# EAGLE design Button-LED-Breakout-v10 (EAGLE 6.4)
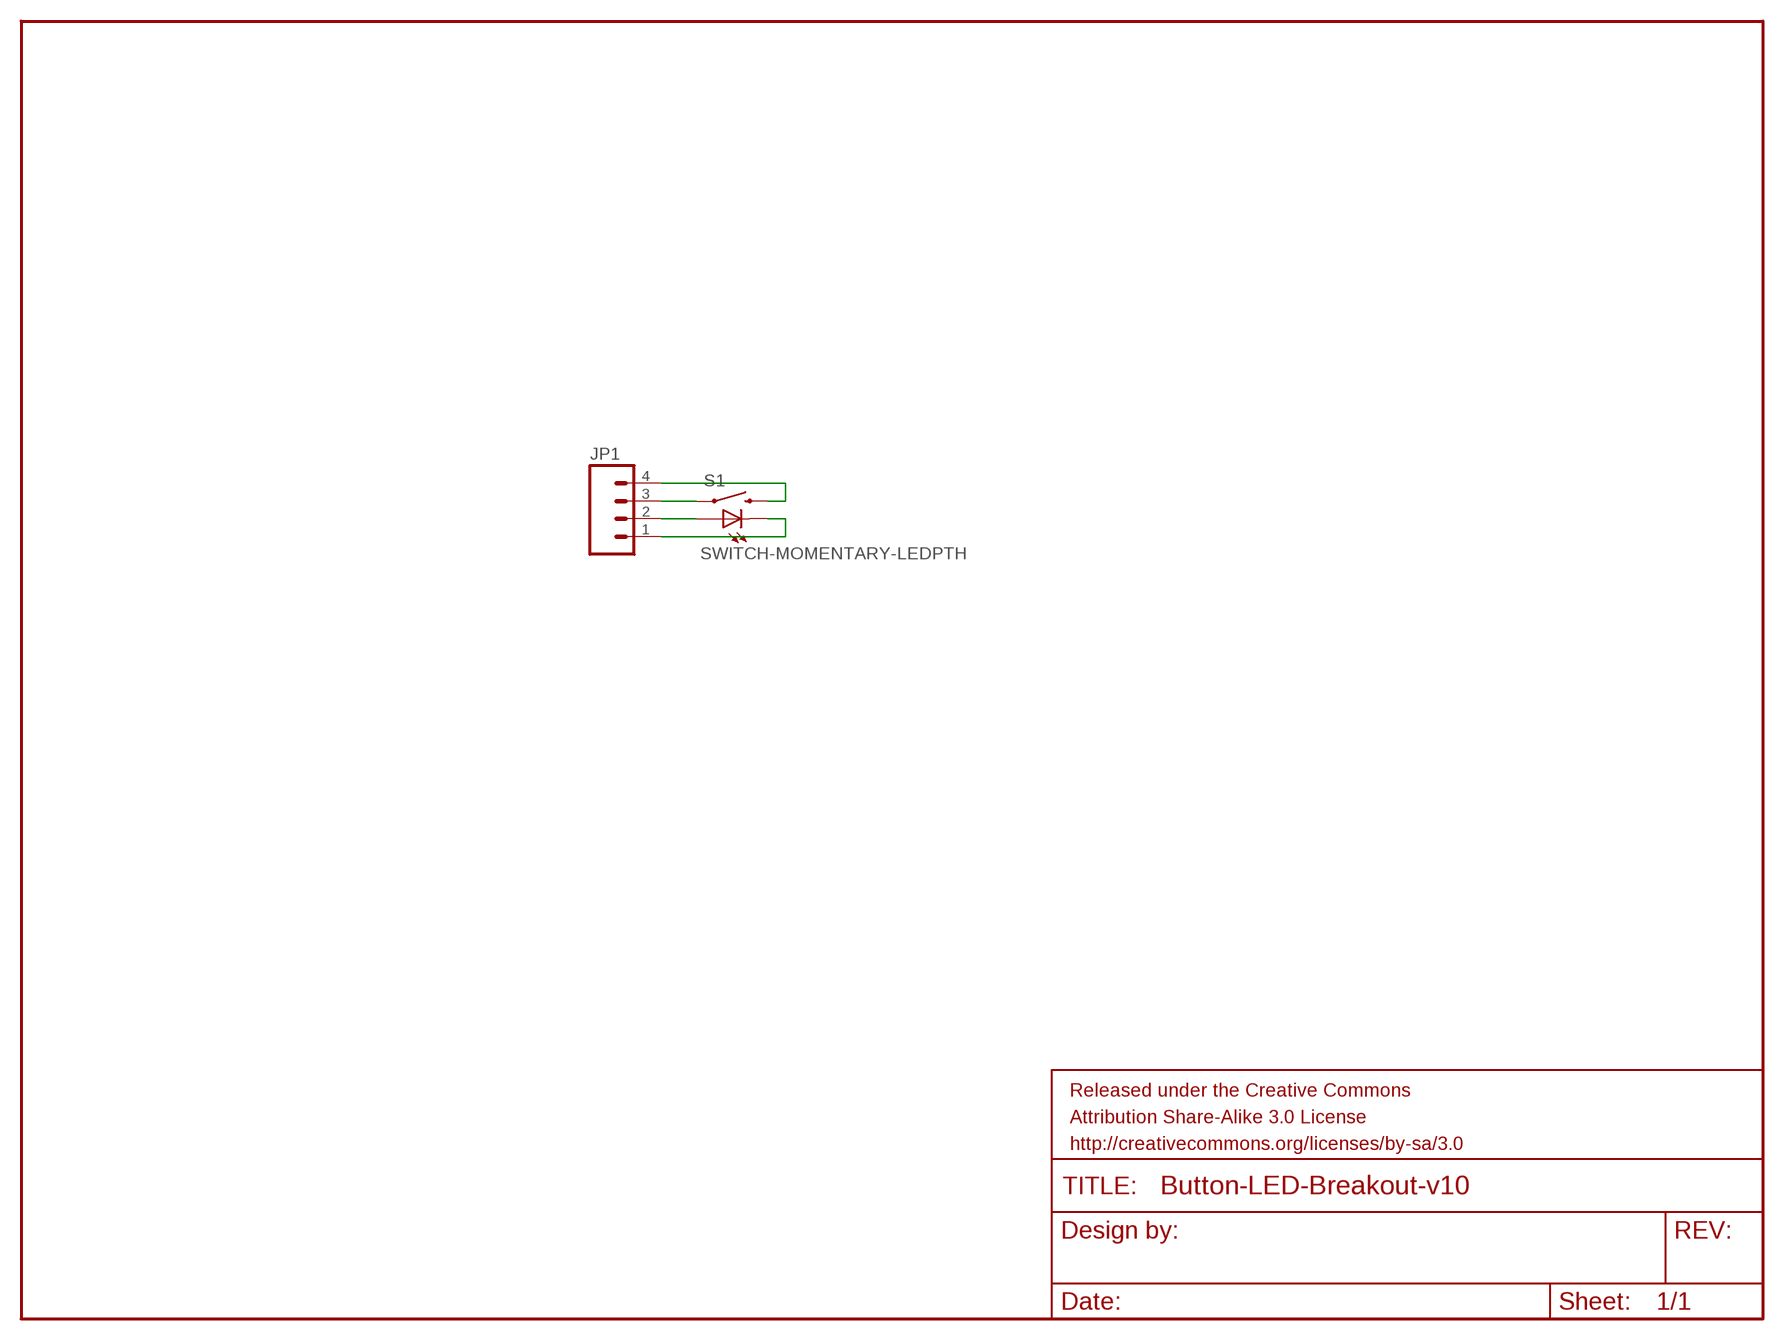
[diagram p0: schematic, sheet 1]

## Parts
FRAME1  FRAME-LETTER  [CREATIVE_COMMONS]
JP1  M04PTH  [1X04]
S1  SWITCH-MOMENTARY-LEDPTH  [TACTILE-PTH-LED-12MM]

## Nets
N$1: JP1.4 S1.2
N$2: JP1.3 S1.4
N$3: JP1.2 S1.A
N$4: JP1.1 S1.C

## Library data of the parts
FRAME1 = SparkFun-Aesthetics:FRAME-LETTER: Schematic Frame Standard 8.5x11 US Letter frame
JP1 = SparkFun-Connectors:M04: Header 4 Standard 4-pin 0.1" header. Use with straight break away headers (SKU : PRT-00116), right angle break away headers (PRT-00553), swiss pins (PRT-00743), machine pins (PRT-00117), and female headers (PRT-00115). Molex polarized connector foot print use with SKU : PRT-08231 with associated crimp pins and housings. 1MM SMD Version SKU: PRT-10208
S1 = SparkFun-Electromechanical:SWITCH-MOMENTARY-LED: EZ is for Kits. There is no tStop (covering up the top side of the pads with mask). This helps the beginner see which side they should be soldering too.

## Board
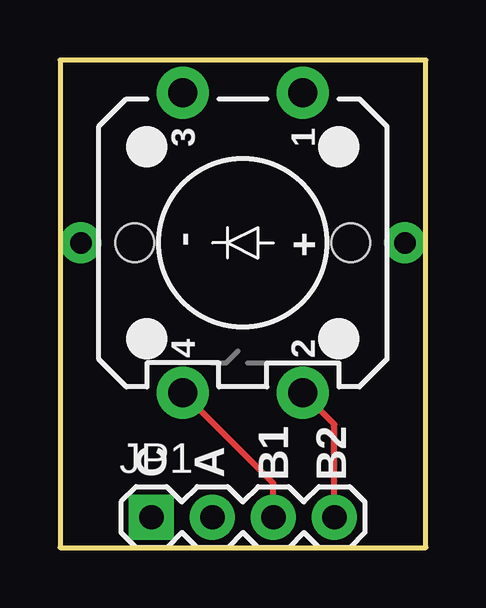
[diagram p1: board, top side]
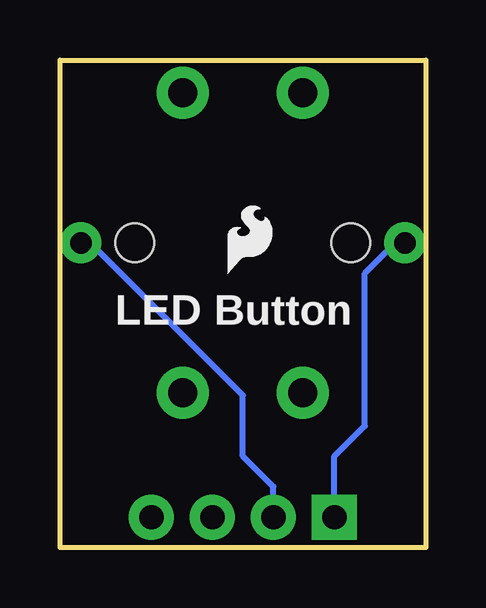
[diagram p2: board, bottom side, seen from below]

Size 15.24 x 20.32 mm. Coordinates in mm from the lower left corner, seen from the top.
Outline: 0,0 15.24,0 15.24,20.32 0,20.32 0,0
Copper layers (1*16): Top 0.035mm / dielectric 1.5mm / Bottom 0.035mm
Design rules "SparkFun": minimum track width 8mil, minimum drill 20mil, track to track 8mil, track to pad 8mil, pad to pad 8mil, via to via 8mil, smd to smd 8mil, copper to edge 8mil, drill to drill 8mil, minimum pad ring 12mil, minimum via ring 10mil, stop-mask expansion 4mil, vias tented up to drill 20mil, thermal gap 10mil

### Footprints (pad centres in the part's own frame; a part is rotated, then mirrored left to right if it is on the bottom)
1X04 = drill 1.016 pad 1.88 square: 1 0,0 | drill 1.016 pad 1.88: 2 2.54,0; 3 5.08,0; 4 7.62,0
TACTILE-PTH-LED-12MM = drill 1.2 pad 2.159: 1 -6.25,2.5; 2 6.25,2.5; 3 -6.25,-2.5; 4 6.25,-2.5 | drill 0.9 pad 1.7: A 0,6.75; C 0,-6.75 | hole 1.6: 0,4.5; 0,-4.5

### Placement (x,y rotation side)
JP1  3.81,1.27 0 top
JP3  LOGO-SFESK  [SFE-LOGO-FLAME]  8.26,11.43 0 bottom
S1  Switch  [TACTILE-PTH-LED-12MM]  7.62,12.7 270 top
U$1  CREATIVE_COMMONS  [CREATIVE_COMMONS]  -5.08,-10.16 0 top  (outside the outline)

### Tracks (layer width: path | path; a pad name or v marks a point on that pad's centre or on a via)
N$1
  Top 0.254: JP1.4 11.43,5.14 S1.2
N$2
  Top 0.254: JP1.3 8.89,2.68 S1.4
N$3
  Bottom 0.254: JP1.2 6.35,2.54 7.62,3.81 7.62,6.35 13.97,12.7 S1.A
N$4
  Bottom 0.254: JP1.1 3.81,3.81 2.54,5.08 2.54,11.43 1.27,12.7 S1.C

### Text on the board
tPlace: C | A | B1 | B2
bPlace: LED Button